# Altium schematic sheet Oscilador.SchDoc
size A4
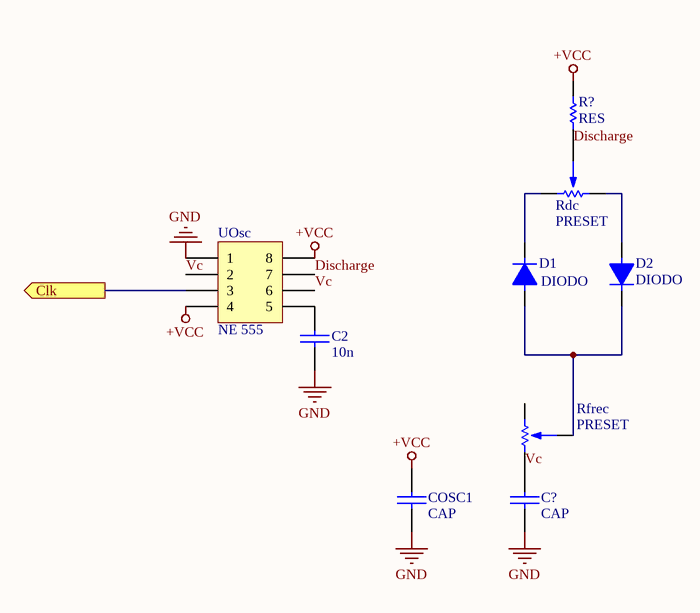
[diagram p0: Oscilador.SchDoc]

## Parts
C2  10n  [CAP200]
C?  CAP  [CAP200]
COSC1  CAP  [CAP200]
D1  DIODO  [DO41]
D2  DIODO  [DO41]
R?  RES  [RES400]
Rdc  PRESET  [PRESET V]
Rfrec  PRESET  [PRESET V]
UOsc  NE 555  [DIP8]

## Ports
Clk (out)

## Nets
+VCC: COSC1.1 R?.1 UOsc.4 UOsc.8
GND: C2.2 C?.2 COSC1.2 UOsc.1
Clk: UOsc.3 ; port Clk
Discharge: R?.2 Rdc.2 UOsc.7
Vc: C?.1 Rfrec.3 UOsc.2 UOsc.6
NetC2_1: C2.1 UOsc.5
NetD1_1: D1.1 D2.2 Rfrec.2
NetD1_2: D1.2 Rdc.1
NetD2_1: D2.1 Rdc.3

Not connected (* = marked no-connect by the designer): Rfrec 1

## Library data of the parts
C2 = CAP
UOsc = IC_DIP8